# Altium schematic sheet DRIVER.SchDoc
size A4
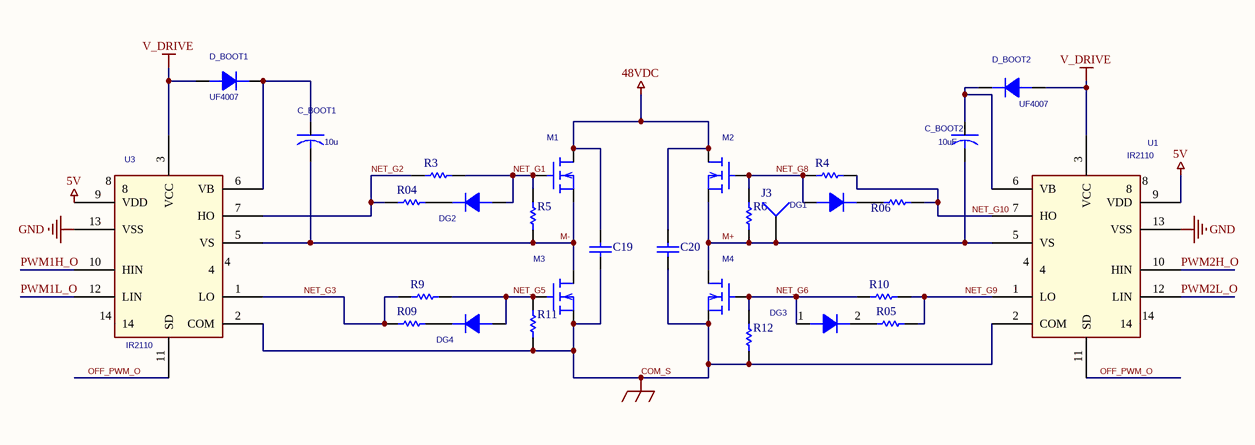
[diagram p0: DRIVER.SchDoc]

## Parts
C19  polypropylen  [2.2UF-1000V_NEW]  (value not drawn)
C20  polypropylen  [2.2UF-1000V_NEW]  (value not drawn)
C_BOOT1  10u  [CAP_10uF_SMD]
C_BOOT2  10uF  [CAP_10uF_SMD]
D_BOOT1  UF4007  [DIODE5819_V1]
D_BOOT2  UF4007  [DIODE5819_V1]
DG1  4148  [4148_SMD]  (value not drawn)
DG2  4148  [4148_SMD]  (value not drawn)
DG3  4148  [4148_SMD]  (value not drawn)
DG4  4148  [4148_SMD]  (value not drawn)
J3  J1  [DAY_50A]  (value not drawn)
M1  IRFP4468PBF-ND  [TO247AB]  (value not drawn)
M2  IRFP4468PBF-ND  [TO247AB]  (value not drawn)
M3  IRFP4468PBF-ND  [TO247AB]  (value not drawn)
M4  IRFP4468PBF-ND  [TO247AB]  (value not drawn)
R3  Resistor SMD0805  [R0805]  (value not drawn)
R4  Resistor SMD0805  [R0805]  (value not drawn)
R04  Resistor SMD0805  [R0805]  (value not drawn)
R5  Resistor SMD0805  [R0805]  (value not drawn)
R05  Resistor SMD0805  [R0805]  (value not drawn)
R6  Resistor SMD0805  [R0805]  (value not drawn)
R06  Resistor SMD0805  [R0805]  (value not drawn)
R9  Resistor SMD0805  [R0805]  (value not drawn)
R09  Resistor SMD0805  [R0805]  (value not drawn)
R10  Resistor SMD0805  [R0805]  (value not drawn)
R11  Resistor SMD0805  [R0805]  (value not drawn)
R12  Resistor SMD0805  [R0805]  (value not drawn)
U1  IR2110  [74HC14]
U3  IR2110  [74HC14]

## Nets
5V: U1.9(VDD) U3.9(VDD)
48VDC: C19.1 C20.1 M1.2(d) M2.2(d)
COM_S: C19.2 C20.2 M3.3(s) M4.3(s) R11.2 R12.2 U1.2(COM) U3.2(COM)  [also labelled GND_EARTH]
GND: U1.13(VSS) U3.13(VSS)
V_DRIVE: D_BOOT1.1(A) D_BOOT2.1(A) U1.3(VCC) U3.3(VCC)
M+: C_BOOT2.2 J3.1 M2.3(s) M4.2(d) R6.2 U1.5(VS)
M-: C_BOOT1.2 M1.3(s) M3.2(d) R5.2 U3.5(VS)
NET_G1: DG2.1(A) M1.1(g) R3.1 R5.1
NET_G2: R3.2 R04.2 U3.7(HO)
NET_G3: R9.2 R09.2 U3.1(LO)
NET_G5: DG4.1(A) M3.1(g) R9.1 R11.1
NET_G6: DG3.1(A) M4.1(g) R10.2 R12.1
NET_G8: DG1.1(A) M2.1(g) R4.2 R6.1
NET_G9: R05.1 R10.1 U1.1(LO)
NET_G10: R4.1 R06.1 U1.7(HO)
OFF_PWM_O: U1.11(SD) U3.11(SD)
PWM1H_O: U3.10(HIN)
PWM1L_O: U3.12(LIN)
PWM2H_O: U1.10(HIN)
PWM2L_O: U1.12(LIN)
NetC_BOOT1_1: C_BOOT1.1 D_BOOT1.2(K) U3.6(VB)
NetC_BOOT2_1: C_BOOT2.1 D_BOOT2.2(K) U1.6(VB)
NetDG1_2: DG1.2(K) R06.2
NetDG2_2: DG2.2(K) R04.1
NetDG3_2: DG3.2(K) R05.2
NetDG4_2: DG4.2(K) R09.1

Not connected (* = marked no-connect by the designer): U1 4 8 14; U3 4 8 14

## Library data of the parts
C19 C20 = Cap Semi: Capacitor polypropylen; Value: 2.2uF 1000V; Published: 8-Jun-2000; LatestRevisionDate: 29-May-2009; LatestRevisionNote: IPC-7351 Footprint Added.; PackageReference: C1206; Publisher: Altium Limited; PackageDescription: Chip Capacitor
C_BOOT1 C_BOOT2 = C_Dup1
D_BOOT1 D_BOOT2 DG1 DG2 DG4 = DIODE
DG3 = DIODE_0
J3 = Socket: LatestRevisionDate: 17-Jul-2002; LatestRevisionNote: Re-released for DXP Platform.; Publisher: Altium Limited
M1-M4 = IRF540_Dup1: PSpiceTemplate: M^@REFDES %d %g %s %s @MODEL
R3 R4 R9 R10 = Res1: Value: 10; Published: 8-Jun-2000; LatestRevisionDate: 17-Jul-2002; LatestRevisionNote: Re-released for DXP Platform.; PackageReference: AXIAL-0.3; Publisher: Altium Limited
R04 R05 R06 R09 = Res1: Value: 4.7; Published: 8-Jun-2000; LatestRevisionDate: 17-Jul-2002; LatestRevisionNote: Re-released for DXP Platform.; PackageReference: AXIAL-0.3; Publisher: Altium Limited
R5 R6 R11 R12 = Res1: Value: 10k; Published: 8-Jun-2000; LatestRevisionDate: 17-Jul-2002; LatestRevisionNote: Re-released for DXP Platform.; PackageReference: AXIAL-0.3; Publisher: Altium Limited
U1 = IR2110_2